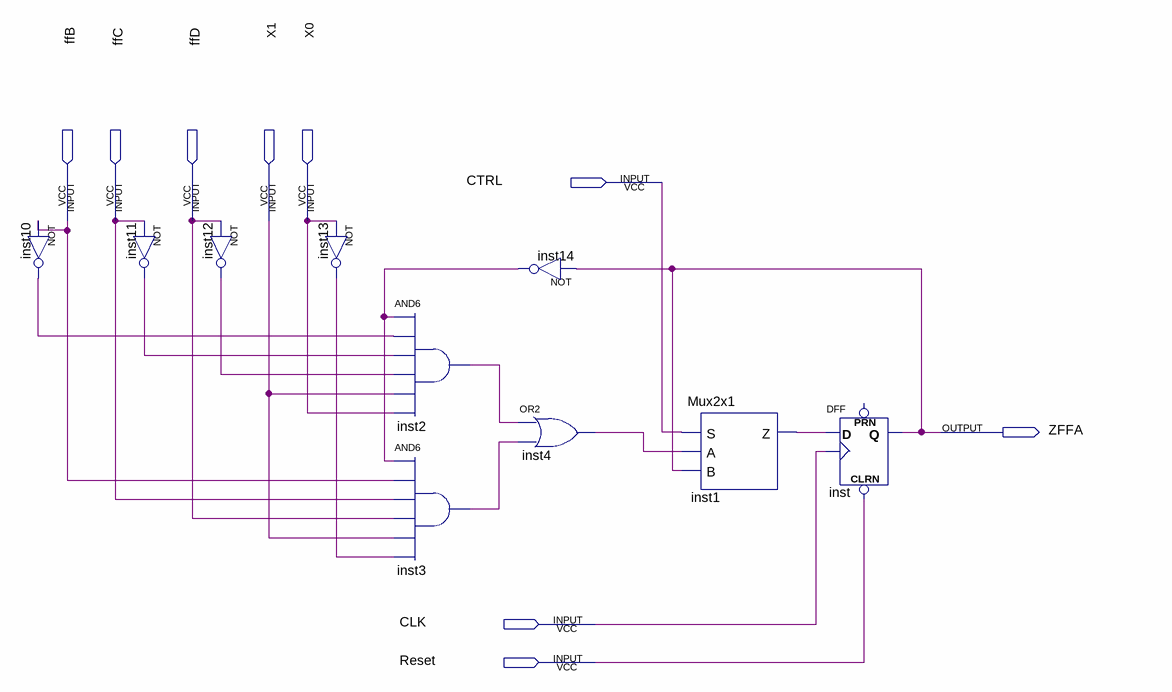
[diagram p0: schematic sheet]
// Quartus schematic EquacaoFFA.bdf as structural Verilog: 10 symbols, 9 pins
module EquacaoFFA (
  input  CTRL,
  input  ffB,
  input  ffC,
  input  ffD,
  input  X1,
  input  X0,
  input  CLK,
  input  Reset,
  output ZFFA
);

  wire inst1_z, inst2_out, inst3_out, inst4_out, inst10_out, inst11_out, inst12_out, inst13_out, inst14_out;

  not inst10 (inst10_out, ffB);
  not inst11 (inst11_out, ffC);
  not inst12 (inst12_out, ffD);
  not inst13 (inst13_out, X0);
  and inst2 (inst2_out, inst14_out, inst10_out, inst11_out, inst12_out, X1, X0);
  and inst3 (inst3_out, inst14_out, ffB, ffC, ffD, X1, inst13_out);
  not inst14 (inst14_out, ZFFA);
  or inst4 (inst4_out, inst2_out, inst3_out);
  Mux2x1 inst1 (.S(CTRL), .A(inst4_out), .B(ZFFA), .Z(inst1_z));
  DFF inst (.CLRN(Reset), .CLK(CLK), .D(inst1_z), .Q(ZFFA));  // open: PRN
endmodule
